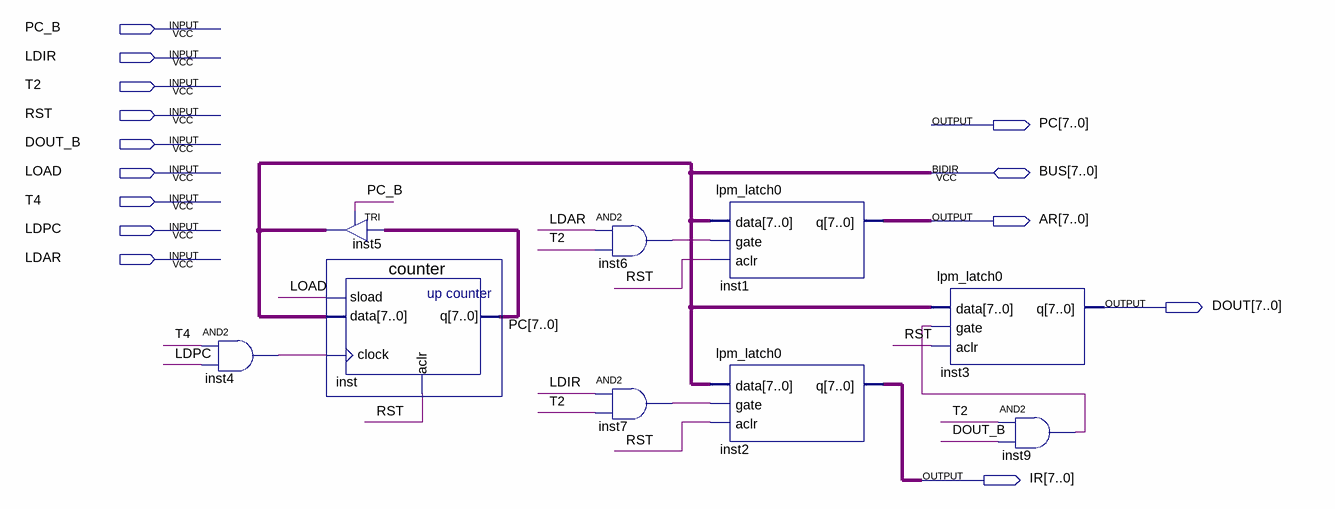
[diagram p0: schematic sheet]
// Quartus schematic REGS_MD.bdf as structural Verilog: 9 symbols, 14 pins
module REGS_MD (
  input  PC_B,
  input  LDIR,
  input  T2,
  input  RST,
  input  DOUT_B,
  input  LOAD,
  input  T4,
  input  LDPC,
  input  LDAR,
  inout  [7:0] BUS,
  output [7:0] PC,
  output [7:0] AR,
  output [7:0] DOUT,
  output [7:0] IR
);

  wire inst4_out, inst6_out, inst7_out, inst9_out;

  and inst4 (inst4_out, T4, LDPC);
  TRI inst5[7:0] (.IN(PC), .OE(PC_B), .OUT(BUS));
  counter inst (.sload(LOAD), .data(BUS), .clock(inst4_out), .aclr(RST), .q(PC));
  and inst6 (inst6_out, LDAR, T2);
  and inst7 (inst7_out, LDIR, T2);
  lpm_latch0 inst1 (.data(BUS), .gate(inst6_out), .aclr(RST), .q(AR));
  lpm_latch0 inst2 (.data(BUS), .gate(inst7_out), .aclr(RST), .q(IR));
  lpm_latch0 inst3 (.data(BUS), .gate(inst9_out), .aclr(RST), .q(DOUT));
  and inst9 (inst9_out, T2, DOUT_B);
endmodule
